# EAGLE design breadboardpower (EAGLE 9.6.2)
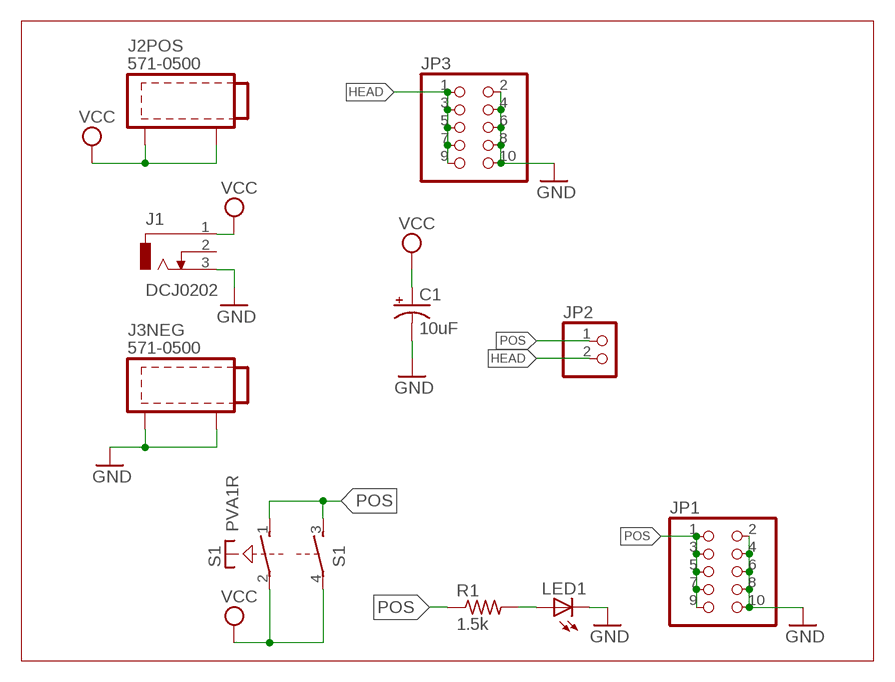
[diagram p0: schematic, sheet 1]

## Parts
C1  10uF  CPOL-USE2.5-5  [E2,5-5]
J1  DCJ0202  [DCJ0202]
J2POS  571-0500  [571-0500]
J3NEG  571-0500  [571-0500]
JP1  PINHD-2X5  [2X05]
JP2  PINHD-1X2  [1X02]
JP3  PINHD-2X5  [2X05]
LED1  LED3MM  [LED3MM]
R1  1.5k  R-US_0207/10  [0207/10]
S1  PVA1R  [PVA1R]

## Nets
GND: C1.- J1.3 J3NEG.1 J3NEG.2 JP1.2 JP1.4 JP1.6 JP1.8 JP1.10 JP3.2 JP3.4 JP3.6 JP3.8 JP3.10 LED1.K(C)
HEAD: JP2.2 JP3.1 JP3.3 JP3.5 JP3.7 JP3.9
N$2: LED1.A R1.2
POS: JP1.1 JP1.3 JP1.5 JP1.7 JP1.9 JP2.1 R1.1 S1.1(1:S) S1.3(2:S)
VCC: C1.+ J1.1 J2POS.1 J2POS.2 S1.2(1:P) S1.4(2:P)
Unconnected: J1.2

## Library data of the parts
C1 = adafruit:CPOL-US: POLARIZED CAPACITOR, American symbol
J1 = con-jack:DCJ0202: DC POWER JACK Source: DCJ0202.pdf; OC_FARNELL: unknown; OC_NEWARK: unknown
J2POS J3NEG = con-deltron:571-0500: FEMALE BANANA JACK stacking pitch 0.394"
JP1 JP3 = pinhead:PINHD-2X5: PIN HEADER
JP2 = pinhead:PINHD-1X2: PIN HEADER
LED1 = adafruit:LED: LED OSRAM: - CHIPLED LG R971, LG N971, LY N971, LG Q971, LY Q971, LO R971, LY R971 LH N974, LH R974 LS Q976, LO Q976, LY Q976 LO Q996 - Hyper CHIPLED LW Q18S LB Q993, LB Q99A, LB R99A - SideLED LS A670, LO A670, LY A670, LG A670, LP A670 LB A673, LV A673, LT A673, LW A673 LH A674 LY A675 LS A676, LA A676, LO A676, LY A676, LW A676 LS A679, LY A679, LG A679 - Hyper Micro SIDELED® LS Y876, LA Y876, LO Y876, LY Y876 LT Y87S - SmartLED LW L88C, LW L88S LB L89C, LB L89S, LG L890 LS L89K, LO L89K, LY L89K LS L896, LA L896, LO L896, LY L896 - TOPLED LS T670, LO T670, LY T670, LG T670, LP T670 LSG T670, LSP T670, LSY T670, LOP T670, LYG T670 LG T671, LOG T671, LSG T671 LB T673, LV T673, LT T673, LW T673 LH T674 LS T676, LA T676, LO T676, LY T676, LB T676, LH T676, LSB T676, LW T676 LB T67C, LV T67C, LT T67C, LS T67K, LO T67K, LY T67K, LW E67C LS E67B, LA E67B, LO E67B, LY E67B, LB E67C, LV E67C, LT E67C LW T67C LS T679, LY T679, LG T679 LS T770, LO T770, LY T770, LG T770, LP T770 LB T773, LV T773, LT T773, LW T773 LH T774 LS E675, LA E675, LY E675, LS T675 LS T776, LA T776, LO T776, LY T776, LB T776 LHGB T686 LT T68C, LB T68C - Hyper Mini TOPLED® LB M676 - Mini TOPLED Santana® LG M470 LS M47K, LO M47K, LY M47K Source: http://www.osram.convergy.de/
R1 = adafruit:R-US_: RESISTOR, American symbol
S1 = switch-misc:PVA1R: ITT SWITCH

## Net classes
0 default: width 1.016 mm

## Board
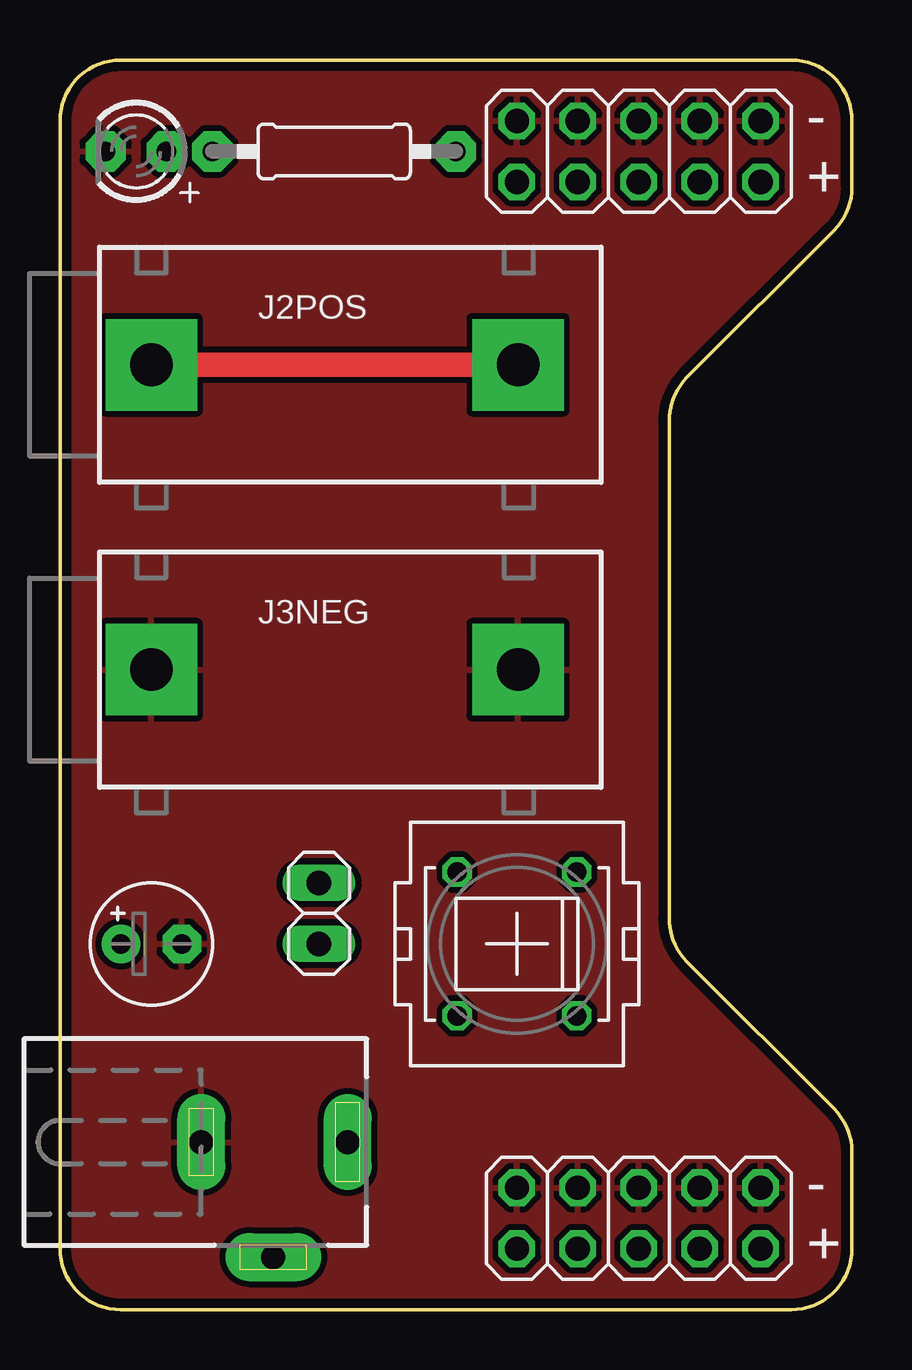
[diagram p1: board, top side]
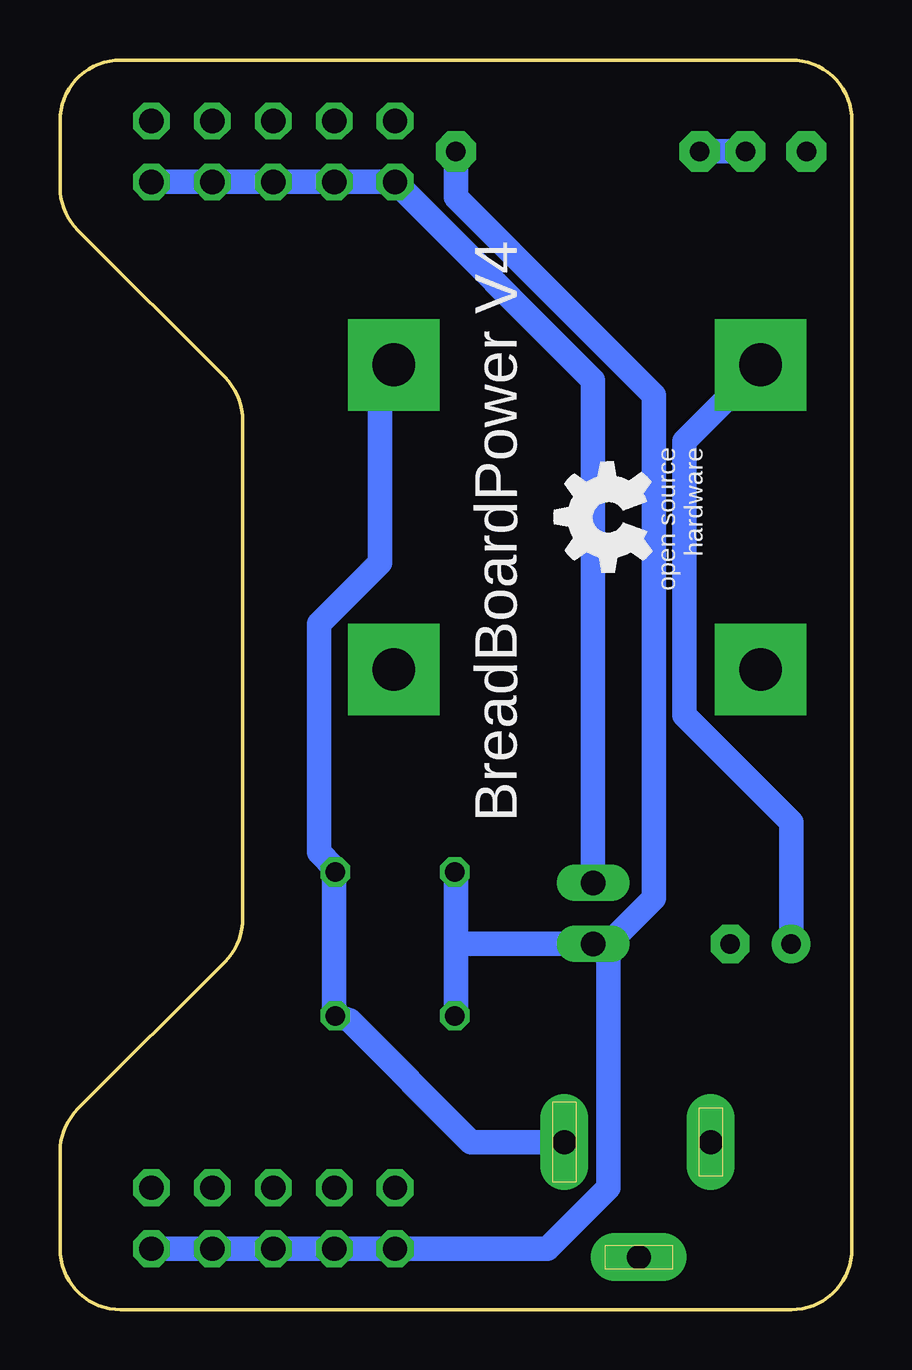
[diagram p2: board, bottom side, seen from below]

Size 33.02 x 52.07 mm. Coordinates in mm from the lower left corner, seen from the top.
Outline: 30.48,0 2.54,0 arc-90 0,2.54 0,49.53 arc-90 2.54,52.07 30.48,52.07 arc-90 33.02,49.53 33.02,46.77 arc-45 32.28,44.98 26.14,38.84 arc45 25.4,37.05 25.4,16.29 arc45 26.14,14.5 32.28,8.36 arc-45 33.02,6.57 33.02,2.54 arc-90 30.48,0
Copper layers (1*16): Top 0.035559375mm / dielectric 1.6mm / Bottom 0.035559375mm
Design rules "oshpark-2layer-auto-routing": minimum track width 10mil, minimum drill 10mil, track to track 10mil, track to pad 8mil, pad to pad 8mil, via to via 8mil, smd to smd 6mil, copper to edge 15mil, drill to drill 6mil, minimum pad ring 6mil, minimum via ring 6mil, stop-mask expansion 2.5mil, vias tented up to drill 0mil, thermal gap 10mil

### Footprints (pad centres in the part's own frame; a part is rotated, then mirrored left to right if it is on the bottom)
E2,5-5 = drill 0.813 pad 1.6: + -1.27,0 | drill 0.813 pad 1.6 octagon: - 1.27,0
DCJ0202 = drill 1 pad 2 long: 1 0,3.1; 2 4.8,0; 3 0,-3
571-0500 = drill 1.778 pad 3.81 square: 1 0,0; 2 -15.291,0
2X05 = drill 1.016 octagon: 1 -5.08,-1.27; 2 -5.08,1.27; 3 -2.54,-1.27; 4 -2.54,1.27; 5 0,-1.27; 6 0,1.27; 7 2.54,-1.27; 8 2.54,1.27; 9 5.08,-1.27; 10 5.08,1.27
1X02 = drill 1.016 long: 1 -1.27,0; 2 1.27,0
LED3MM = drill 0.813 pad 1.676 octagon: A -1.27,0; K 1.27,0
0207/10 = drill 0.813 pad 1.676 octagon: 1 -5.08,0; 2 5.08,0
PVA1R = drill 0.813 octagon: 1 -2.997,2.489; 2 -2.997,-2.489; 3 2.997,2.489; 4 2.997,-2.489

### Placement (x,y rotation side)
C1  3.81,15.24 0 top
J1  8.89,6.99 270 top
J2POS  3.81,39.37 180 top
J3NEG  3.81,26.67 180 top
JP1  24.13,3.81 0 top
JP2  10.79,16.51 90 top
JP3  24.13,48.26 0 top
LED1  3.17,48.26 180 top
R1  11.43,48.26 180 top
S1  19.05,15.24 90 top
U$1  [OSHW_5MM]  10.16,33.02 90 bottom

### Tracks (layer width: path | path; a pad name or v marks a point on that pad's centre or on a via)
GND
  pour Top: -2.54,55.88 -2.54,-2.54 35.56,-2.54 35.56,55.88
HEAD
  Bottom 1.016: JP2.2 10.79,38.73 JP3.1 JP3.3 JP3.5 JP3.7 JP3.9
N$2
  Bottom 1.016: R1.2 LED1.A
POS
  Bottom 1.016: JP1.9 JP1.7 JP1.5 JP1.3 JP1.1 12.7,2.54 10.16,5.08 10.16,15.24 | 16.51,15.24 16.51,17.78 S1.3 | 16.51,15.24 16.51,12.7 S1.1 | 16.51,15.24 JP2.1 10.16,15.24 | R1.1 16.51,46.35 8.26,38.1 8.26,17.14 10.16,15.24
VCC
  Top 1.016: J2POS.2 J2POS.1
  Bottom 1.016: C1.+ 2.54,20.32 6.99,24.77 6.99,36.2 J2POS.1 | J1.1 15.88,6.99 20.95,12.06 S1.2 21.59,12.7 21.59,17.78 S1.4 21.59,18.41 22.23,19.05 22.23,28.57 19.68,31.11 19.68,39.37 J2POS.2

### Text on the board
tNames: - | + | - | +
bNames: BreadBoardPower V4